# EAGLE schematic TEST1 (EAGLE 6.0)
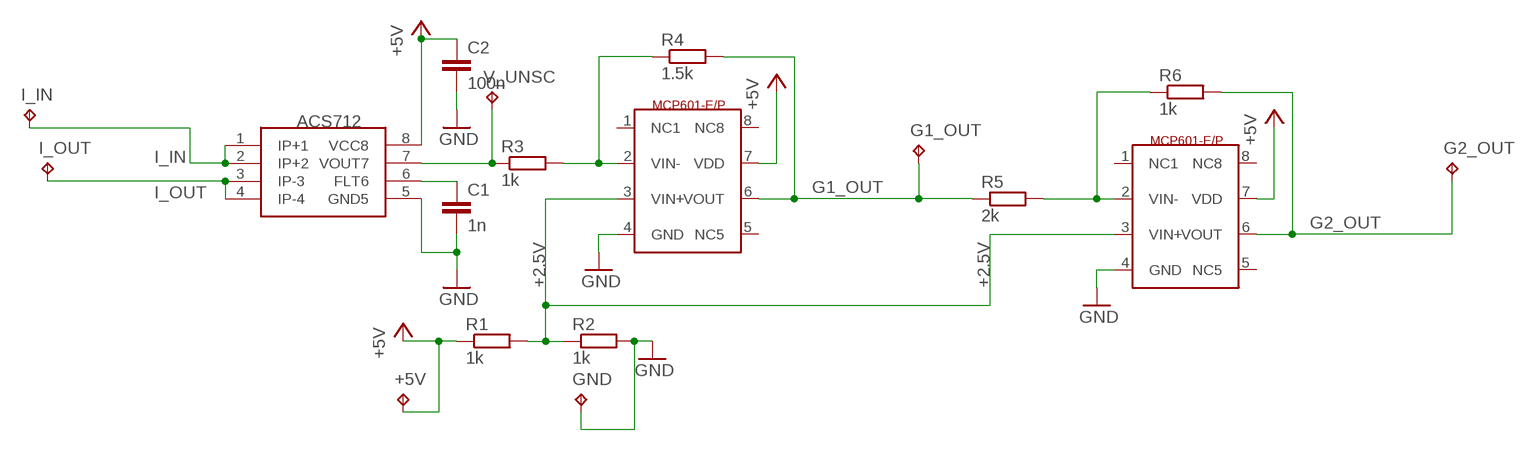
[diagram p0: schematic, sheet 1]

## Parts
+5V  TPPAD1-17Y  [P1-17Y]
C1  1n  C-EU050-050X075  [C050-050X075]
C2  100n  C-EU050-050X075  [C050-050X075]
G1_OUT  TPPAD1-17Y  [P1-17Y]
G2_OUT  TPPAD1-17Y  [P1-17Y]
GND  TPPAD1-17Y  [P1-17Y]
I_IN  TPPAD1-17Y  [P1-17Y]
I_OUT  TPPAD1-17Y  [P1-17Y]
R1  1k  R-EU_0309/12  [0309/12]
R2  1k  R-EU_0309/12  [0309/12]
R3  1k  R-EU_0309/12  [0309/12]
R4  1.5k  R-EU_0309/12  [0309/12]
R5  2k  R-EU_0309/12  [0309/12]
R6  1k  R-EU_0309/12  [0309/12]
U$1  ACS712  [SOIC8]
U$2  MCP601  [PDIP8]
U$3  MCP601  [PDIP8]
V_UNSC  TPPAD1-17Y  [P1-17Y]

## Nets
+2.5V: R1.2 R2.1 U$2.3(VIN+) U$3.3(VIN+)
+5V: +5V.TP C2.1 R1.1 U$1.8(VCC8) U$2.7(VDD) U$3.7(VDD)
G1_OUT: G1_OUT.TP R4.2 R5.1 U$2.6(VOUT)
G2_OUT: G2_OUT.TP R6.2 U$3.6(VOUT)
GND: C1.2 C2.2 GND.TP R2.2 U$1.5(GND5) U$2.4(GND) U$3.4(GND)
I_IN: I_IN.TP U$1.1(IP+1) U$1.2(IP+2)
I_OUT: I_OUT.TP U$1.3(IP-3) U$1.4(IP-4)
N$1: R3.1 U$1.7(VOUT7) V_UNSC.TP
N$2: R3.2 R4.1 U$2.2(VIN-)
N$4: R5.2 R6.1 U$3.2(VIN-)
N$8: C1.1 U$1.6(FLT6)
Unconnected: U$2.1(NC1) U$2.5(NC5) U$2.8(NC8) U$3.1(NC1) U$3.5(NC5) U$3.8(NC8)

## Library data of the parts
+5V G1_OUT G2_OUT GND I_IN I_OUT V_UNSC = testpad:TP: Test pad
C1 C2 = resistor:C-EU: CAPACITOR, European symbol
R1-R6 = resistor:R-EU_: RESISTOR, European symbol
U$1 = Pauls_parts:ACS712
U$2 U$3 = Pauls_parts:MCP601